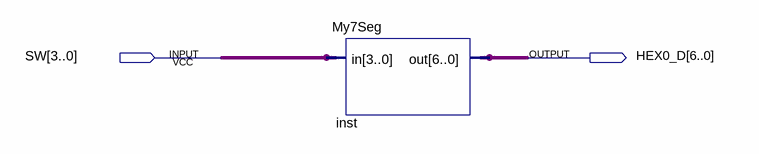
[diagram p0: schematic sheet]
// Quartus schematic My_7_seg.bdf as structural Verilog: 1 symbols, 2 pins
module My_7_seg (
  input  [3:0] SW,
  output [6:0] HEX0_D
);

  My7Seg inst (.in(SW), .out(HEX0_D));
endmodule
